# EAGLE design tinytx3 (EAGLE 6.2)
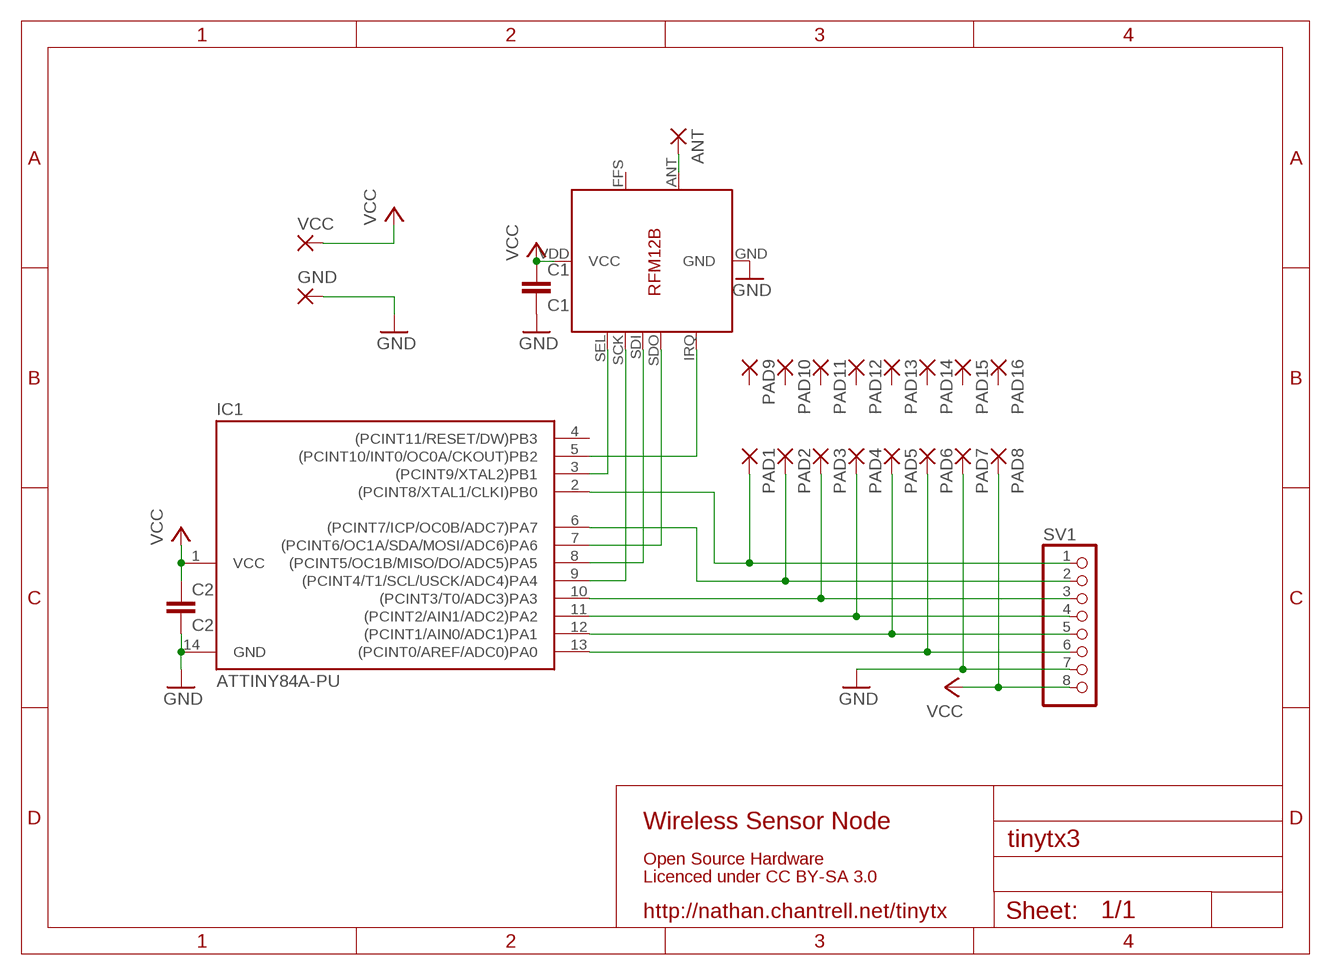
[diagram p0: schematic, sheet 1]

## Parts
ANT  1,6/0,8  [1,6/0,8]
C1  C1  C-EU025-025X050  [C025-025X050]
C2  C2  C-EU025-025X050  [C025-025X050]
GND  2,15/1,0  [2,15/1,0]
IC1  ATTINY84A-PU  TINY24/44/84-PU  [DIL14]
PAD1  1,6/0,9  [1,6/0,9]
PAD2  1,6/0,9  [1,6/0,9]
PAD3  1,6/0,9  [1,6/0,9]
PAD4  1,6/0,9  [1,6/0,9]
PAD5  1,6/0,9  [1,6/0,9]
PAD6  1,6/0,9  [1,6/0,9]
PAD7  1,6/0,9  [1,6/0,9]
PAD8  1,6/0,9  [1,6/0,9]
PAD9  1,6/0,9  [1,6/0,9]
PAD10  1,6/0,9  [1,6/0,9]
PAD11  1,6/0,9  [1,6/0,9]
PAD12  1,6/0,9  [1,6/0,9]
PAD13  1,6/0,9  [1,6/0,9]
PAD14  1,6/0,9  [1,6/0,9]
PAD15  1,6/0,9  [1,6/0,9]
PAD16  1,6/0,9  [1,6/0,9]
SV1  PINHD-1X8  [1X08]
U$1  RFM12B  [RFM12B]
VCC  2,15/1,0  [2,15/1,0]

## Nets
GND: C1.2 C2.2 GND.1(P) IC1.14(GND) PAD7.1(P) SV1.7 U$1.GND
N$1: IC1.3((PCINT9/XTAL2)PB1) U$1.SEL
N$2: IC1.5((PCINT10/INT0/OC0A/CKOUT)PB2) U$1.IRQ
N$3: IC1.8((PCINT5/OC1B/MISO/DO/ADC5)PA5) U$1.SDI
N$4: IC1.7((PCINT6/OC1A/SDA/MOSI/ADC6)PA6) U$1.SDO
N$5: ANT.1(P) U$1.ANT
N$6: IC1.9((PCINT4/T1/SCL/USCK/ADC4)PA4) U$1.SCK
N$8: IC1.6((PCINT7/ICP/OC0B/ADC7)PA7) PAD2.1(P) SV1.2
N$9: IC1.13((PCINT0/AREF/ADC0)PA0) PAD6.1(P) SV1.6
N$10: IC1.12((PCINT1/AIN0/ADC1)PA1) PAD5.1(P) SV1.5
N$11: IC1.2((PCINT8/XTAL1/CLKI)PB0) PAD1.1(P) SV1.1
N$13: IC1.11((PCINT2/AIN1/ADC2)PA2) PAD4.1(P) SV1.4
N$14: IC1.10((PCINT3/T0/ADC3)PA3) PAD3.1(P) SV1.3
VCC: C1.1 C2.1 IC1.1(VCC) PAD8.1(P) SV1.8 U$1.VDD(VCC) VCC.1(P)
Unconnected: IC1.4((PCINT11/RESET/DW)PB3) PAD9.1(P) PAD10.1(P) PAD11.1(P) PAD12.1(P) PAD13.1(P) PAD14.1(P) PAD15.1(P) PAD16.1(P) U$1.FFS

## Notes on the sheet
- Wireless Sensor Node
- Open Source Hardware
- Licenced under CC BY-SA 3.0
- http://nathan.chantrell.net/tinytx

## Library data of the parts
ANT = wirepad:1,6/0,8: THROUGH-HOLE PAD
C1 C2 = rcl:C-EU: CAPACITOR, European symbol
GND VCC = wirepad:2,15/1,0: THROUGH-HOLE PAD
IC1 = avr-5:TINY24/44/84
PAD1-PAD16 = wirepad:1,6/0,9: THROUGH-HOLE PAD
SV1 = pinhead:PINHD-1X8: PIN HEADER
U$1 = JeeParts:RFM12B

## Board
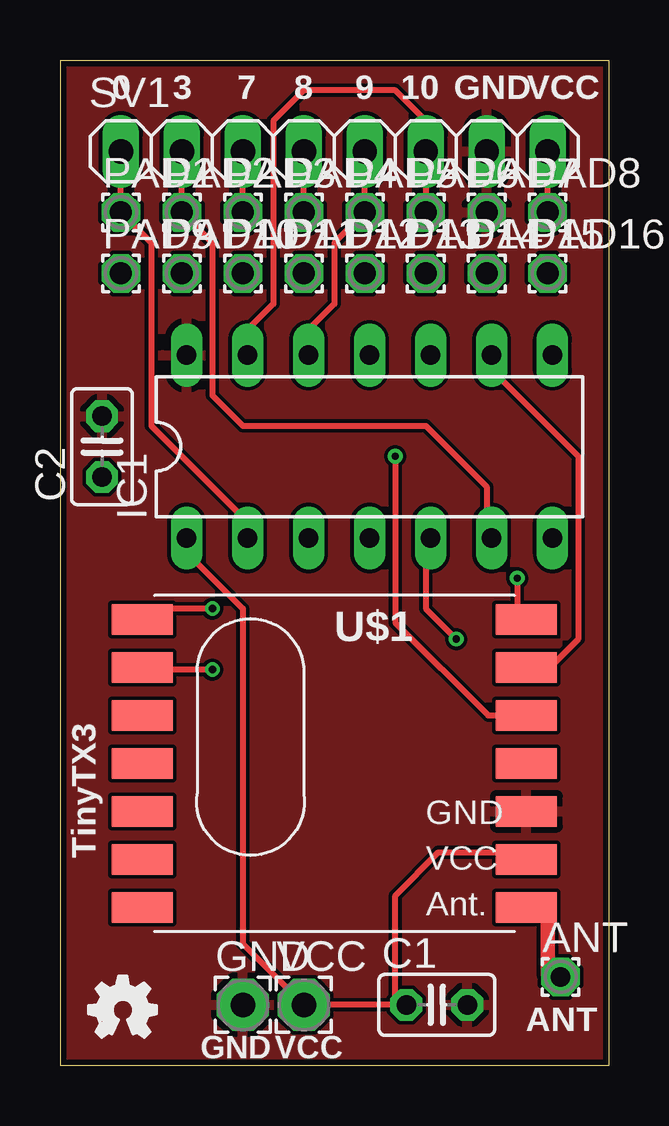
[diagram p1: board, top side]
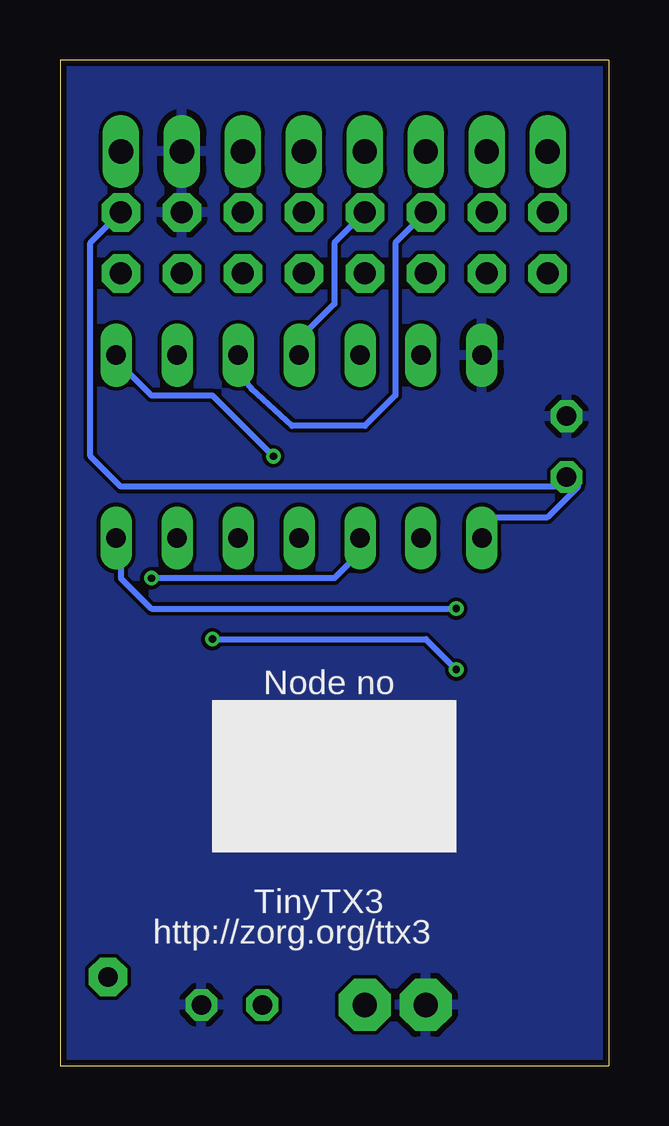
[diagram p2: board, bottom side, seen from below]

Size 22.86 x 41.91 mm. Coordinates in mm from the lower left corner, seen from the top.
Outline: 0,41.91 22.86,41.91 22.86,0 0,0 0,41.91
Copper layers (1*16): Top 0.035mm / dielectric 1.5mm / Bottom 0.035mm
Design rules: minimum track width 6mil, minimum drill 12mil, track to track 6mil, track to pad 6mil, pad to pad 6mil, via to via 6mil, smd to smd 0mil, copper to edge 10mil, drill to drill 10mil, minimum pad ring 10mil, minimum via ring 6mil, stop-mask expansion 2mil, vias tented up to drill 100mil, thermal gap 10mil

### Footprints (pad centres in the part's own frame; a part is rotated, then mirrored left to right if it is on the bottom)
1,6/0,8 = drill 0.813 pad 1.6 octagon: 1 0,0
C025-025X050 = drill 0.813 octagon: 1 -1.27,0; 2 1.27,0
2,15/1,0 = drill 1.016 pad 2.159 octagon: 1 0,0
DIL14 = drill 0.813 long: 1 -7.62,-3.81; 2 -5.08,-3.81; 3 -2.54,-3.81; 4 0,-3.81; 5 2.54,-3.81; 6 5.08,-3.81; 7 7.62,-3.81; 8 7.62,3.81; 9 5.08,3.81; 10 2.54,3.81; 11 0,3.81; 12 -2.54,3.81; 13 -5.08,3.81; 14 -7.62,3.81
1,6/0,9 = drill 0.914 pad 1.6 octagon: 1 0,0
1X08 = drill 1.016 long: 1 -8.89,0; 2 -6.35,0; 3 -3.81,0; 4 -1.27,0; 5 1.27,0; 6 3.81,0; 7 6.35,0; 8 8.89,0
RFM12B = smd 2.54 x 1.27: ANT 8,-6; FFS -8,2; GND 8,-2; IRQ -8,4; P$8 -8,0; P$9 -8,-2; P$10 -8,-4; P$12 -8,-6; P$16 8,0; SCK 8,4; SDI 8,2; SDO -8,6; SEL 8,6; VDD 8,-4

### Placement (x,y rotation side)
ANT  20.86,3.71 0 top
C1  15.7,2.54 0 top
C2  1.75,25.8 90 top
GND  7.62,2.54 0 top
IC1  12.9,25.8 0 top
PAD1  2.54,35.56 0 top
PAD2  5.08,35.56 0 top
PAD3  7.62,35.56 0 top
PAD4  10.16,35.56 0 top
PAD5  12.7,35.56 0 top
PAD6  15.24,35.56 0 top
PAD7  17.78,35.56 0 top
PAD8  20.32,35.56 0 top
PAD9  2.54,33.02 0 top
PAD10  5.08,33.02 0 top
PAD11  7.62,33.02 0 top
PAD12  10.16,33.02 0 top
PAD13  12.7,33.02 0 top
PAD14  15.24,33.02 0 top
PAD15  17.78,33.02 0 top
PAD16  20.32,33.02 0 top
SV1  11.43,38.1 0 top
U$1  11.43,12.6 0 top
U$2  [OSHW_FILLX100_NOTEXT]  1.2,1.2 0 top
VCC  10.16,2.54 0 top

### Tracks (layer width: path | path; a pad name or v marks a point on that pad's centre or on a via)
GND
  pour Bottom: 0,41.91 22.86,41.91 22.86,0 0,0
  pour Top: 0,41.91 22.86,41.91 22.86,0 0,0
N$1  (via drill 0.3)
  Top 0.254: v19.05,20.32 19.05,19.05 U$1.SEL
  Bottom 0.254: v19.05,20.32 11.43,20.32 10.16,21.59 IC1.3
N$2  (via drill 0.3)
  Top 0.254: v6.35,16.51 3.81,16.51 U$1.IRQ | v16.51,17.78 15.24,19.05 15.24,21.59 IC1.5
  Bottom 0.254: v6.35,16.51 7.62,17.78 v16.51,17.78
N$3  (via drill 0.3)
  Top 0.254: v13.97,25.4 13.97,18.46 17.83,14.6 U$1.SDI
  Bottom 0.254: v13.97,25.4 16.51,27.94 19.05,27.94 20.32,29.21 IC1.8
N$4  (via drill 0.3)
  Top 0.254: v6.35,19.05 3.81,19.05 U$1.SDO
  Bottom 0.254: v6.35,19.05 19.05,19.05 20.32,20.32 20.32,21.59 IC1.7
N$5
  Top 0.254: 20.32,6.3 U$1.ANT | 20.32,3.81 ANT.1
  Top 0.61: 20.32,3.81 20.32,6.3
N$6
  Top 0.254: U$1.SCK 20.32,16.51 21.59,17.78 21.59,25.4 17.78,29.21 IC1.9
N$8
  Top 0.254: IC1.6 17.78,21.59 17.78,24.13 15.24,26.67 7.62,26.67 6.35,27.94 6.35,34.29 PAD2.1 SV1.2
N$9
  Top 0.254: IC1.13 7.62,30.48 8.89,31.75 8.89,39.37 10.16,40.64 13.97,40.64 15.24,39.37 SV1.6 PAD6.1
N$10
  Top 0.254: IC1.12 10.16,30.48 11.43,31.75 11.43,34.29 PAD5.1 SV1.5
N$11
  Top 0.254: IC1.2 7.62,22.86 3.81,26.67 3.81,34.29 PAD1.1 SV1.1
N$13
  Top 0.254: PAD4.1 SV1.4
  Bottom 0.254: PAD4.1 11.43,34.29 11.43,31.75 12.7,30.48 IC1.11
N$14
  Top 0.254: PAD3.1 SV1.3
  Bottom 0.254: PAD3.1 8.89,34.29 8.89,27.94 10.16,26.67 13.19,26.67 14.88,28.2 15.96,29.39 IC1.10
VCC
  Top 0.254: 20.32,8.89 U$1.VDD 19.05,8.89 15.77,8.89 13.97,7.09 13.97,2.54 | 13.97,2.54 VCC.1 7.62,5.08 7.62,19.05 5.08,21.59 IC1.1 | 13.97,2.54 C1.1 | PAD8.1 SV1.8
  Bottom 0.254: 1.27,24.13 2.54,22.86 5.08,22.86 IC1.1 | PAD8.1 21.59,34.29 21.59,25.4 20.32,24.13 1.27,24.13 | 1.27,24.13 C2.1

### Text on the board
_tsilk: 0 | 3 | 7 | 8 | 9 | 10 | GND | VCC | TinyTX3 | ANT | GND | VCC
_bsilk: Node no | TinyTX3 | http://zorg.org/ttx3